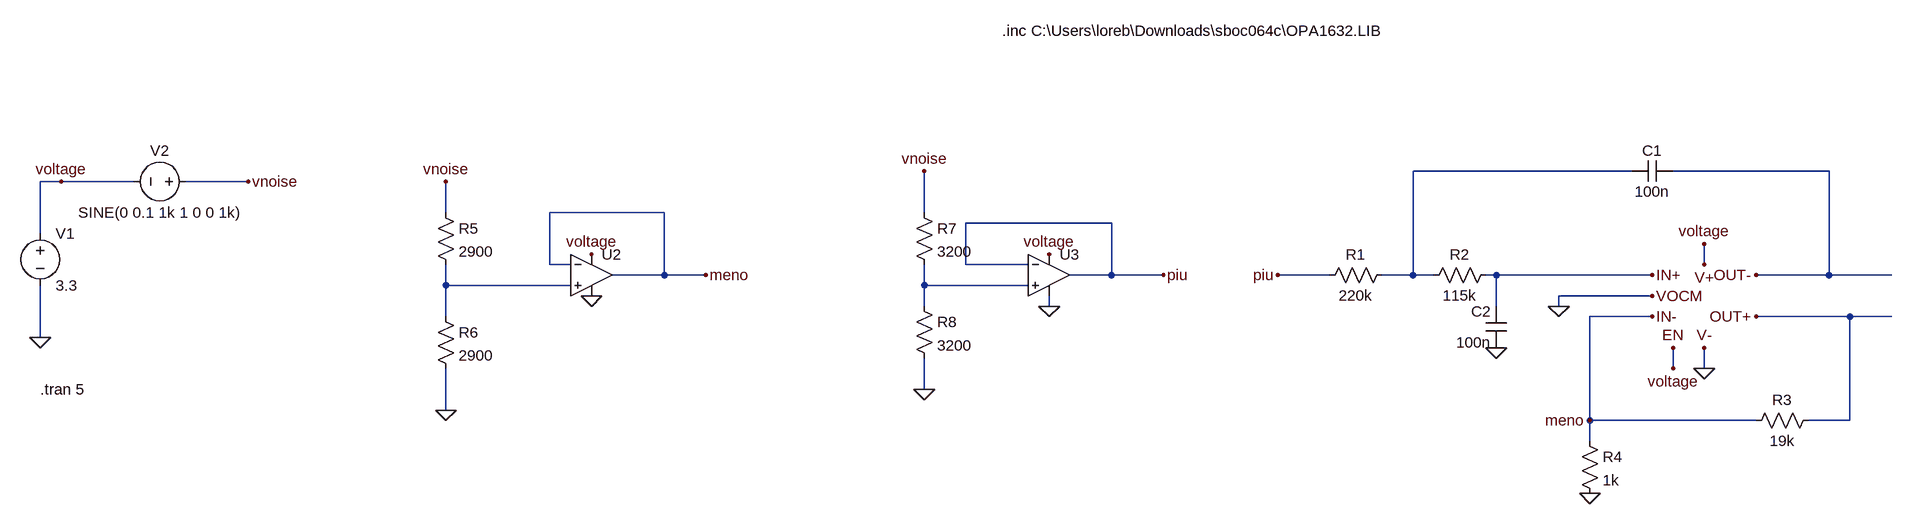
[diagram p0: schematic FDA.asc]
FDA.asc, the LTspice schematic file:
Version 4
SHEET 1 964 776
WIRE 256 192 -80 192
WIRE 560 192 320 192
WIRE -2160 208 -2192 208
WIRE -2048 208 -2160 208
WIRE -1872 208 -1968 208
WIRE -1568 256 -1568 208
WIRE -1232 256 -1408 256
WIRE -832 256 -832 192
WIRE -544 272 -768 272
WIRE -2192 288 -2192 208
WIRE -1408 336 -1408 256
WIRE -1376 336 -1408 336
WIRE -768 336 -768 272
WIRE -672 336 -768 336
WIRE 368 336 368 304
WIRE -1232 352 -1232 256
WIRE -1232 352 -1312 352
WIRE -1168 352 -1232 352
WIRE -544 352 -544 272
WIRE -544 352 -608 352
WIRE -464 352 -544 352
WIRE -208 352 -288 352
WIRE -80 352 -80 192
WIRE -80 352 -128 352
WIRE -48 352 -80 352
WIRE 48 352 32 352
WIRE 288 352 48 352
WIRE 560 352 560 192
WIRE 560 352 448 352
WIRE 656 352 560 352
WIRE -1568 368 -1568 336
WIRE -1376 368 -1568 368
WIRE -832 368 -832 336
WIRE -672 368 -832 368
WIRE 288 384 144 384
WIRE -832 400 -832 368
WIRE -640 400 -640 384
WIRE 48 400 48 352
WIRE 144 400 144 384
WIRE -1568 416 -1568 368
WIRE 288 416 192 416
WIRE 592 416 448 416
WIRE 656 416 592 416
WIRE -2192 448 -2192 368
WIRE 320 496 320 464
WIRE 368 496 368 464
WIRE -832 528 -832 480
WIRE -1568 560 -1568 496
WIRE 192 576 192 416
WIRE 448 576 192 576
WIRE 592 576 592 416
WIRE 592 576 528 576
WIRE 192 608 192 576
FLAG 192 688 0
FLAG 48 464 0
FLAG -832 528 0
FLAG -1568 560 0
FLAG -2192 448 0
FLAG -2160 208 voltage
FLAG -1872 208 vnoise
FLAG -1344 384 0
FLAG -640 400 0
FLAG -1568 208 vnoise
FLAG -832 192 vnoise
FLAG -1344 320 voltage
FLAG -640 320 voltage
FLAG -464 352 piu
FLAG -1168 352 meno
FLAG -288 352 piu
FLAG 368 304 voltage
FLAG 320 496 voltage
FLAG 144 400 0
FLAG 368 496 0
FLAG 192 576 meno
FLAG 368 336 V+
FLAG 448 352 OUT-
FLAG 448 416 OUT+
FLAG 368 464 V-
FLAG 320 464 EN
FLAG 288 416 IN-
FLAG 288 384 VOCM
FLAG 288 352 IN+
SYMBOL res -112 336 R90
WINDOW 0 0 56 VBottom 2
WINDOW 3 32 56 VTop 2
SYMATTR InstName R1
SYMATTR Value 220k
SYMBOL res 48 336 R90
WINDOW 0 0 56 VBottom 2
WINDOW 3 32 56 VTop 2
SYMATTR InstName R2
SYMATTR Value 115k
SYMBOL cap 320 176 R90
WINDOW 0 0 32 VBottom 2
WINDOW 3 32 32 VTop 2
SYMATTR InstName C1
SYMATTR Value 100n
SYMBOL cap 64 464 R180
WINDOW 0 24 56 Left 2
WINDOW 3 24 8 Left 2
SYMATTR InstName C2
SYMATTR Value 100n
SYMBOL res 544 560 R90
WINDOW 0 0 56 VBottom 2
WINDOW 3 32 56 VTop 2
SYMATTR InstName R3
SYMATTR Value 19k
SYMBOL res 176 592 R0
SYMATTR InstName R4
SYMATTR Value 1k
SYMBOL res -1584 240 R0
SYMATTR InstName R5
SYMATTR Value 2900
SYMBOL res -1584 400 R0
SYMATTR InstName R6
SYMATTR Value 2900
SYMBOL res -848 240 R0
SYMATTR InstName R7
SYMATTR Value 3200
SYMBOL res -848 384 R0
SYMATTR InstName R8
SYMATTR Value 3200
SYMBOL OpAmps\\UniversalOpAmp2 -1344 352 R0
SYMATTR InstName U2
SYMBOL OpAmps\\UniversalOpAmp2 -640 352 R0
SYMATTR InstName U3
SYMBOL voltage -2192 272 R0
WINDOW 123 0 0 Left 0
WINDOW 39 0 0 Left 0
SYMATTR InstName V1
SYMATTR Value 3.3
SYMBOL voltage -1952 208 R90
WINDOW 0 -32 56 VBottom 2
WINDOW 3 32 56 VTop 2
WINDOW 123 0 0 Left 0
WINDOW 39 0 0 Left 0
SYMATTR InstName V2
SYMATTR Value SINE(0 0.1 1k 1 0 0 1k)
TEXT -712 -24 Left 2 !.inc C:\\Users\\loreb\\Downloads\\sboc064c\\OPA1632.LIB
TEXT -2192 528 Left 2 !.tran 5

The netlist it stands for:
* FDA.asc
R1 N001 piu 220k
R2 IN+ N001 115k
C1 OUT- N001 100n
C2 0 IN+ 100n
R3 OUT+ IN- 19k
R4 IN- 0 1k
R5 vnoise N002 2900
R6 N002 0 2900
R7 vnoise N003 3200
R8 N003 0 3200
XU2 N002 IN- EN 0 IN- level2 Avol=1Meg GBW=10Meg Slew=10Meg Ilimit=25m Rail=0 Vos=0 En=0 Enk=0 In=0 Ink=0 Rin=500Meg  ; pins In+ In- V+ V- OUT
XU3 N003 piu EN 0 piu level2 Avol=1Meg GBW=10Meg Slew=10Meg Ilimit=25m Rail=0 Vos=0 En=0 Enk=0 In=0 Ink=0 Rin=500Meg  ; pins In+ In- V+ V- OUT
V1 EN 0 3.3
V2 vnoise EN SINE(0 0.1 1k 1 0 0 1k)
.inc C:\Users\loreb\Downloads\sboc064c\OPA1632.LIB
.tran 5
.lib UniversalOpAmp2.lib
.backanno
.end